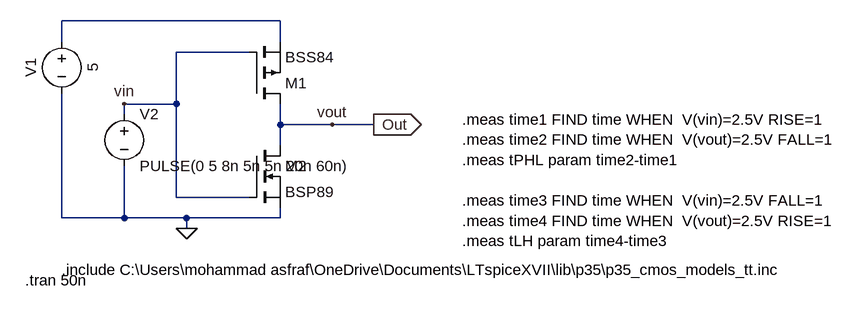
[diagram p0: schematic Propagation_Delay_Calc.asc]
Propagation_Delay_Calc.asc, the LTspice schematic file:
Version 4
SHEET 1 888 680
WIRE 256 96 -80 96
WIRE -80 128 -80 96
WIRE 256 128 256 96
WIRE 208 144 96 144
WIRE 96 224 96 144
WIRE 96 224 16 224
WIRE 16 240 16 224
WIRE 256 256 256 224
WIRE 336 256 256 256
WIRE 400 256 336 256
WIRE 256 288 256 256
WIRE 96 368 96 224
WIRE 208 368 96 368
WIRE -80 400 -80 208
WIRE 16 400 16 320
WIRE 16 400 -80 400
WIRE 112 400 16 400
WIRE 256 400 256 384
WIRE 256 400 112 400
WIRE 112 416 112 400
FLAG 112 416 0
FLAG 400 256 Out
IOPIN 400 256 Out
FLAG 16 224 vin
FLAG 336 256 vout
SYMBOL pmos 208 224 M180
SYMATTR InstName M1
SYMATTR Value BSS84
SYMBOL nmos 208 288 R0
SYMATTR InstName M2
SYMATTR Value BSP89
SYMBOL voltage -80 112 R0
WINDOW 0 -32 56 VBottom 2
WINDOW 3 32 56 VTop 2
WINDOW 123 0 0 Left 0
WINDOW 39 0 0 Left 0
SYMATTR InstName V1
SYMATTR Value 5
SYMBOL voltage 16 224 R0
WINDOW 123 0 0 Left 0
WINDOW 39 0 0 Left 0
SYMATTR InstName V2
SYMATTR Value PULSE(0 5 8n 5n 5n 20n 60n)
TEXT -80 480 Left 2 !.include C:\\Users\\mohammad asfraf\\OneDrive\\Documents\\LTspiceXVII\\lib\\p35\\p35_cmos_models_tt.inc
TEXT 536 248 Left 2 !.meas time1 FIND time WHEN  V(vin)=2.5V RISE=1\n.meas time2 FIND time WHEN  V(vout)=2.5V FALL=1\n.meas tPHL param time2-time1\n \n.meas time3 FIND time WHEN  V(vin)=2.5V FALL=1\n.meas time4 FIND time WHEN  V(vout)=2.5V RISE=1\n.meas tLH param time4-time3
TEXT -136 496 Left 2 !.tran 50n

The netlist it stands for:
* Propagation_Delay_Calc.asc
M1 vout vin N001 N001 BSS84
M2 vout vin 0 0 BSP89
V1 N001 0 5
V2 vin 0 PULSE(0 5 8n 5n 5n 20n 60n)
.model NMOS NMOS
.model PMOS PMOS
.lib standard.mos
.include C:\Users\mohammad asfraf\OneDrive\Documents\LTspiceXVII\lib\p35\p35_cmos_models_tt.inc
.meas time1 FIND time WHEN  V(vin)=2.5V RISE=1
.meas time2 FIND time WHEN  V(vout)=2.5V FALL=1
.meas tPHL param time2-time1
.meas time3 FIND time WHEN  V(vin)=2.5V FALL=1
.meas time4 FIND time WHEN  V(vout)=2.5V RISE=1
.meas tLH param time4-time3
.tran 50n
.backanno
.end